# Altium project Smart-Car.PrjPcb
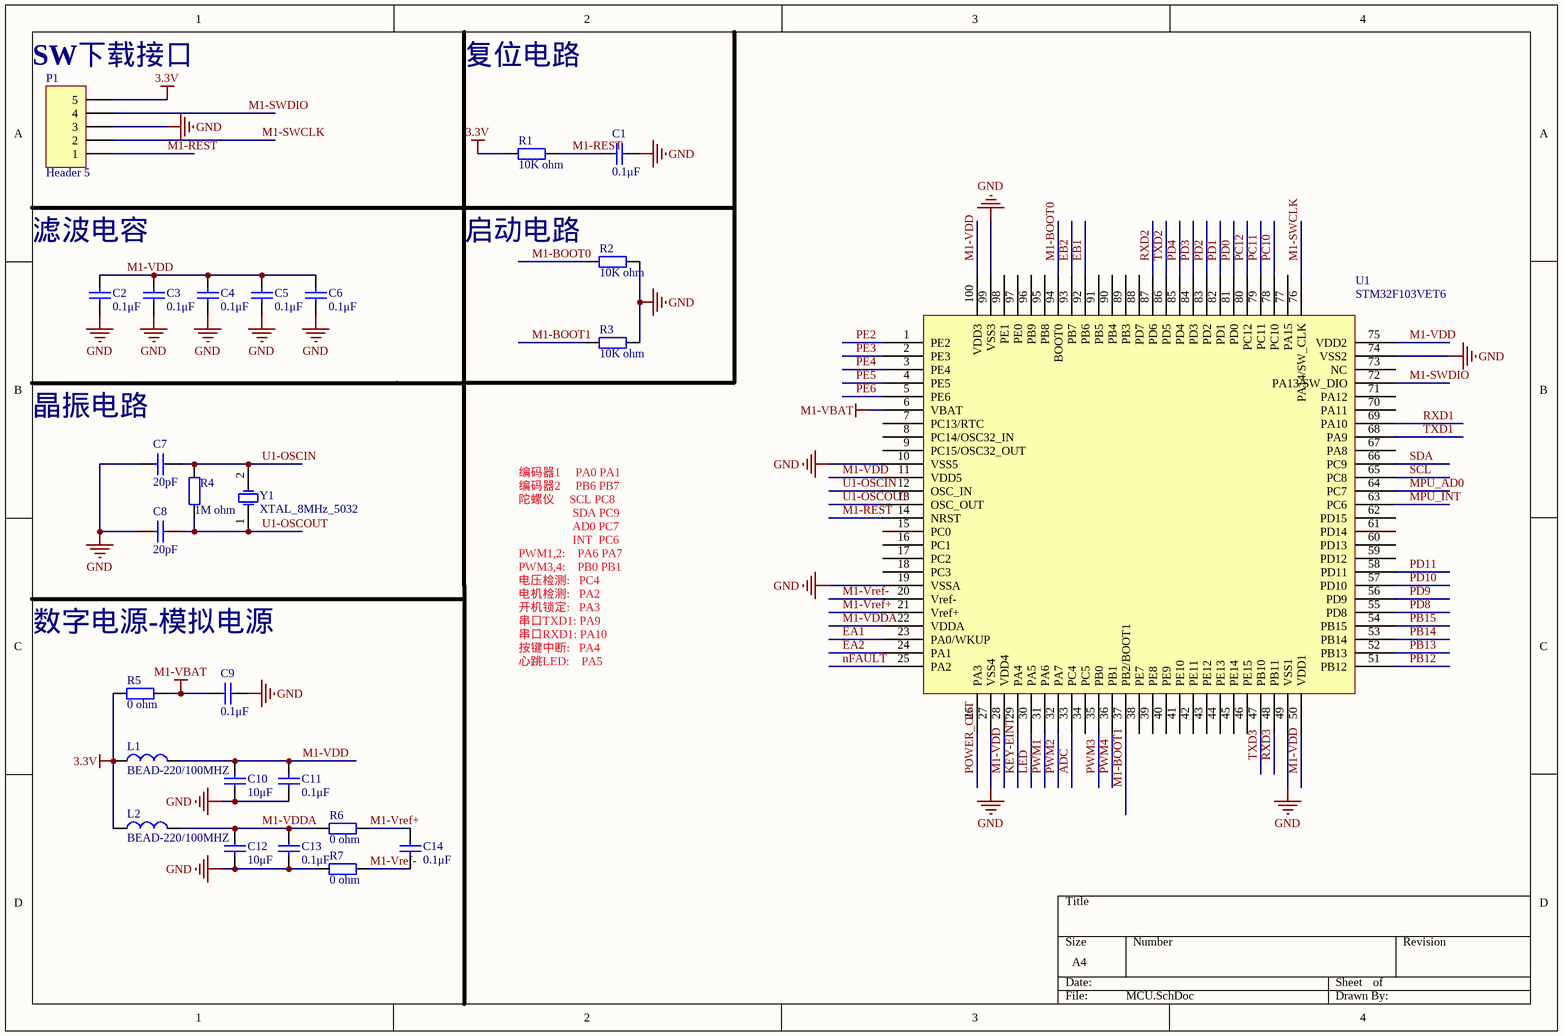
[diagram p0: MCU.SchDoc]
6 sheets, 161 parts. Net scope: global (net labels, ports and power ports of the same name join across sheets).
Board file: Smart-Car.PcbDoc
Sheets:
  MCU.SchDoc
  Power.SchDoc
  Module.SchDoc
  Extend.SchDoc
  KT1025A.SchDoc
  Voice.SchDoc

## Sheet MCU.SchDoc
size A4

### Parts
C1  0.1μF  [0603C]
C2  0.1μF  [0603C]
C3  0.1μF  [0603C]
C4  0.1μF  [0603C]
C5  0.1μF  [0603C]
C6  0.1μF  [0603C]
C7  20pF  [0603C]
C8  20pF  [0603C]
C9  0.1μF  [0603C]
C10  10μF  [0603C]
C11  0.1μF  [0603C]
C12  10μF  [0603C]
C13  0.1μF  [0603C]
C14  0.1μF  [0603C]
L1  BEAD-220/100MHZ  [0603R]
L2  BEAD-220/100MHZ  [0603R]
P1  Header 5  [HDR1X5]
R1  10K ohm  [0603R]
R2  10K ohm  [0603R]
R3  10K ohm  [0603R]
R4  1M ohm  [0603R]
R5  0 ohm  [0603R]
R6  0 ohm  [0603R]
R7  0 ohm  [0603R]
U1  STM32F103VET6  [LQFP100]
Y1  XTAL_8MHz_5032  [5032]

### Nets
3.3V: L1.1 L2.1 P1.5 R1.1 R5.1
GND: C1.2 C2.1 C3.1 C4.1 C5.1 C6.1 C7.1 C8.1 C9.1 C10.1 C11.1 C12.1 C13.1 P1.3 R2.2 R3.2 R7.1 U1.10(VSS5) U1.19(VSSA) U1.27(VSS4) U1.49(VSS1) U1.74(VSS2) U1.99(VSS3)
M1-VBAT: C9.2 R5.2 U1.6(VBAT)
ADC: U1.33(PC4)
EA1: U1.23(PA0/WKUP)
EA2: U1.24(PA1)
EB1: U1.92(PB6)
EB2: U1.93(PB7)
KEY-EINT: U1.29(PA4)
LED: U1.30(PA5)
M1-BOOT0: R2.1 U1.94(BOOT0)
M1-BOOT1: R3.1 U1.37(PB2/BOOT1)
M1-REST: C1.1 P1.1 R1.2 U1.14(NRST)
M1-SWCLK: P1.2 U1.76(PA14/SW_CLK)
M1-SWDIO: P1.4 U1.72(PA13/SW_DIO)
M1-VDD: C2.2 C3.2 C4.2 C5.2 C6.2 C10.2 C11.2 L1.2 U1.11(VDD5) U1.28(VDD4) U1.50(VDD1) U1.75(VDD2) U1.100(VDD3)
M1-VDDA: C12.2 C13.2 L2.2 R6.1 U1.22(VDDA)
M1-Vref+: C14.2 R6.2 U1.21(Vref+)
M1-Vref-: C14.1 R7.2 U1.20(Vref-)
MPU_AD0: U1.64(PC7)
MPU_INT: U1.63(PC6)
nFAULT: U1.25(PA2)
PB12: U1.51(PB12)
PB13: U1.52(PB13)
PB14: U1.53(PB14)
PB15: U1.54(PB15)
PC10: U1.78(PC10)
PC11: U1.79(PC11)
PC12: U1.80(PC12)
PD0: U1.81(PD0)
PD1: U1.82(PD1)
PD2: U1.83(PD2)
PD3: U1.84(PD3)
PD4: U1.85(PD4)
PD8: U1.55(PD8)
PD9: U1.56(PD9)
PD10: U1.57(PD10)
PD11: U1.58(PD11)
PE2: U1.1(PE2)
PE3: U1.2(PE3)
PE4: U1.3(PE4)
PE5: U1.4(PE5)
PE6: U1.5(PE6)
POWER_OUT: U1.26(PA3)
PWM1: U1.31(PA6)
PWM2: U1.32(PA7)
PWM3: U1.35(PB0)
PWM4: U1.36(PB1)
RXD1: U1.69(PA10)
RXD2: U1.87(PD6)
RXD3: U1.48(PB11)
SCL: U1.65(PC8)
SDA: U1.66(PC9)
TXD1: U1.68(PA9)
TXD2: U1.86(PD5)
TXD3: U1.47(PB10)
U1-OSCIN: C7.2 R4.2 U1.12(OSC_IN) Y1.2(OSC2)
U1-OSCOUT: C8.2 R4.1 U1.13(OSC_OUT) Y1.1(OSC1)

Not connected (* = marked no-connect by the designer): U1 7(PC13/RTC) 8(PC14/OSC32_IN) 9(PC15/OSC32_OUT) 15(PC0) 16(PC1) 17(PC2) 18(PC3) 34(PC5) 38(PE7) 39(PE8) 40(PE9) 41(PE10) 42(PE11) 43(PE12) 44(PE13) 45(PE14) 46(PE15) 59(PD12) 60(PD13) 61(PD14) 62(PD15) 67(PA8) 70(PA11) 71(PA12) 73(NC) 77(PA15) 88(PD7) 89(PB3) 90(PB4) 91(PB5) 95(PB8) 96(PB9) 97(PE0) 98(PE1)

### Notes on the sheet
- (near P1) SW下载接口
- 复位电路
- 滤波电容
- 启动电路
- 晶振电路
- 数字电源-模拟电源
- 编码器1     PA0 PA1
  编码器2     PB6 PB7
  陀螺仪     SCL PC8
  SDA PC9
  AD0 PC7
  INT  PC6
  PWM1,2:    PA6 PA7
  PWM3,4:    PB0 PB1
  电压检测:   PC4
  电机检测:   PA2
  开机锁定:   PA3
  串口TXD1: PA9
  串口RXD1: PA10
  按键中断:   PA4
  心跳LED:    PA5

### Library data of the parts
C1-C6 C9 C11 C13 C14 = Cap_0.1μF_50V_0603: 0.1μF_50V,X7R,±5%; 物料名称: 贴片陶瓷电容; 制造商: muRata; 物料编码: TCC0087; 物料型号: GRM188R71H104JA93D; 单位: PCS; 物料规格: 0.1μF_50V,X7R,±5%
C7 C8 = Cap_20pF_50V_0603: 20pF_50V,CH,±5%; 物料名称: 贴片陶瓷电容; 制造商: muRata; 物料编码: TCC0036; 物料型号: GRM1882C1H200JA01D; 单位: PCS; 物料规格: 20pF_50V,CH,±5%
C10 C12 = Cap_10μF_35V_0603: 10μF_35V,X5R,20%; 物料规格: 10μF_35V,20%; 物料名称: 贴片陶瓷电容; 制造商: muRata; 物料编码: TCC0071; 物料型号: GRM188R6YA106MA73D; 单位: PCS
L1 L2 = BEAD-220/100MHZ_0603: 物料名称: 磁珠; 制造商: TDK; 物料编码: TCZ0006; 物料型号: MMZ1608B221CTAH0; 单位: PCS; 物料规格: BEAD-220/100MHZ
P1 = Header 5: Header, 5-Pin; LatestRevisionDate: 17-Jul-2002; LatestRevisionNote: Re-released for DXP Platform.; Publisher: Altium Limited
R1-R3 = Res_10K ohm_0603: 10K ohm,1%; 物料名称: 贴片电阻; 制造商: YAGEO; 物料编码: TRS0020; 物料型号: RC0603FR-0710KL; 单位: PCS; 物料规格: 10K ohm,1%
R4 = Res_1M ohm_0603: 1M ohm,1%; 物料名称: 贴片电阻; 制造商: YAGEO; 物料编码: TRS0067; 物料型号: RC0603FR-071ML; 单位: PCS; 物料规格: 1M ohm,1%
R5-R7 = Res_0 ohm_0603: 0 ohm,5%; 物料名称: 贴片电阻; 制造商: YAGEO; 物料编码: TRS0003; 物料型号: RC0603JR-070RL; 单位: PCS; 物料规格: 0 ohm,5%
U1 = STM32F103VET6: 物料名称: 32位微处理器; 制造商: ST; 物料编码: TIC0019; 单位: PCS; 物料规格: STM32F103VET6; 物料型号: STM32F103VET6
Y1 = XTAL_8MHz_5032: XTAL_8MHz; 物料规格: 8MHz; 物料名称: 晶振; 制造商: TAITIEN; 物料编码: NA; 物料型号: XIHCCCNANF-8.000; 单位: PCS

## Sheet Power.SchDoc
size A3
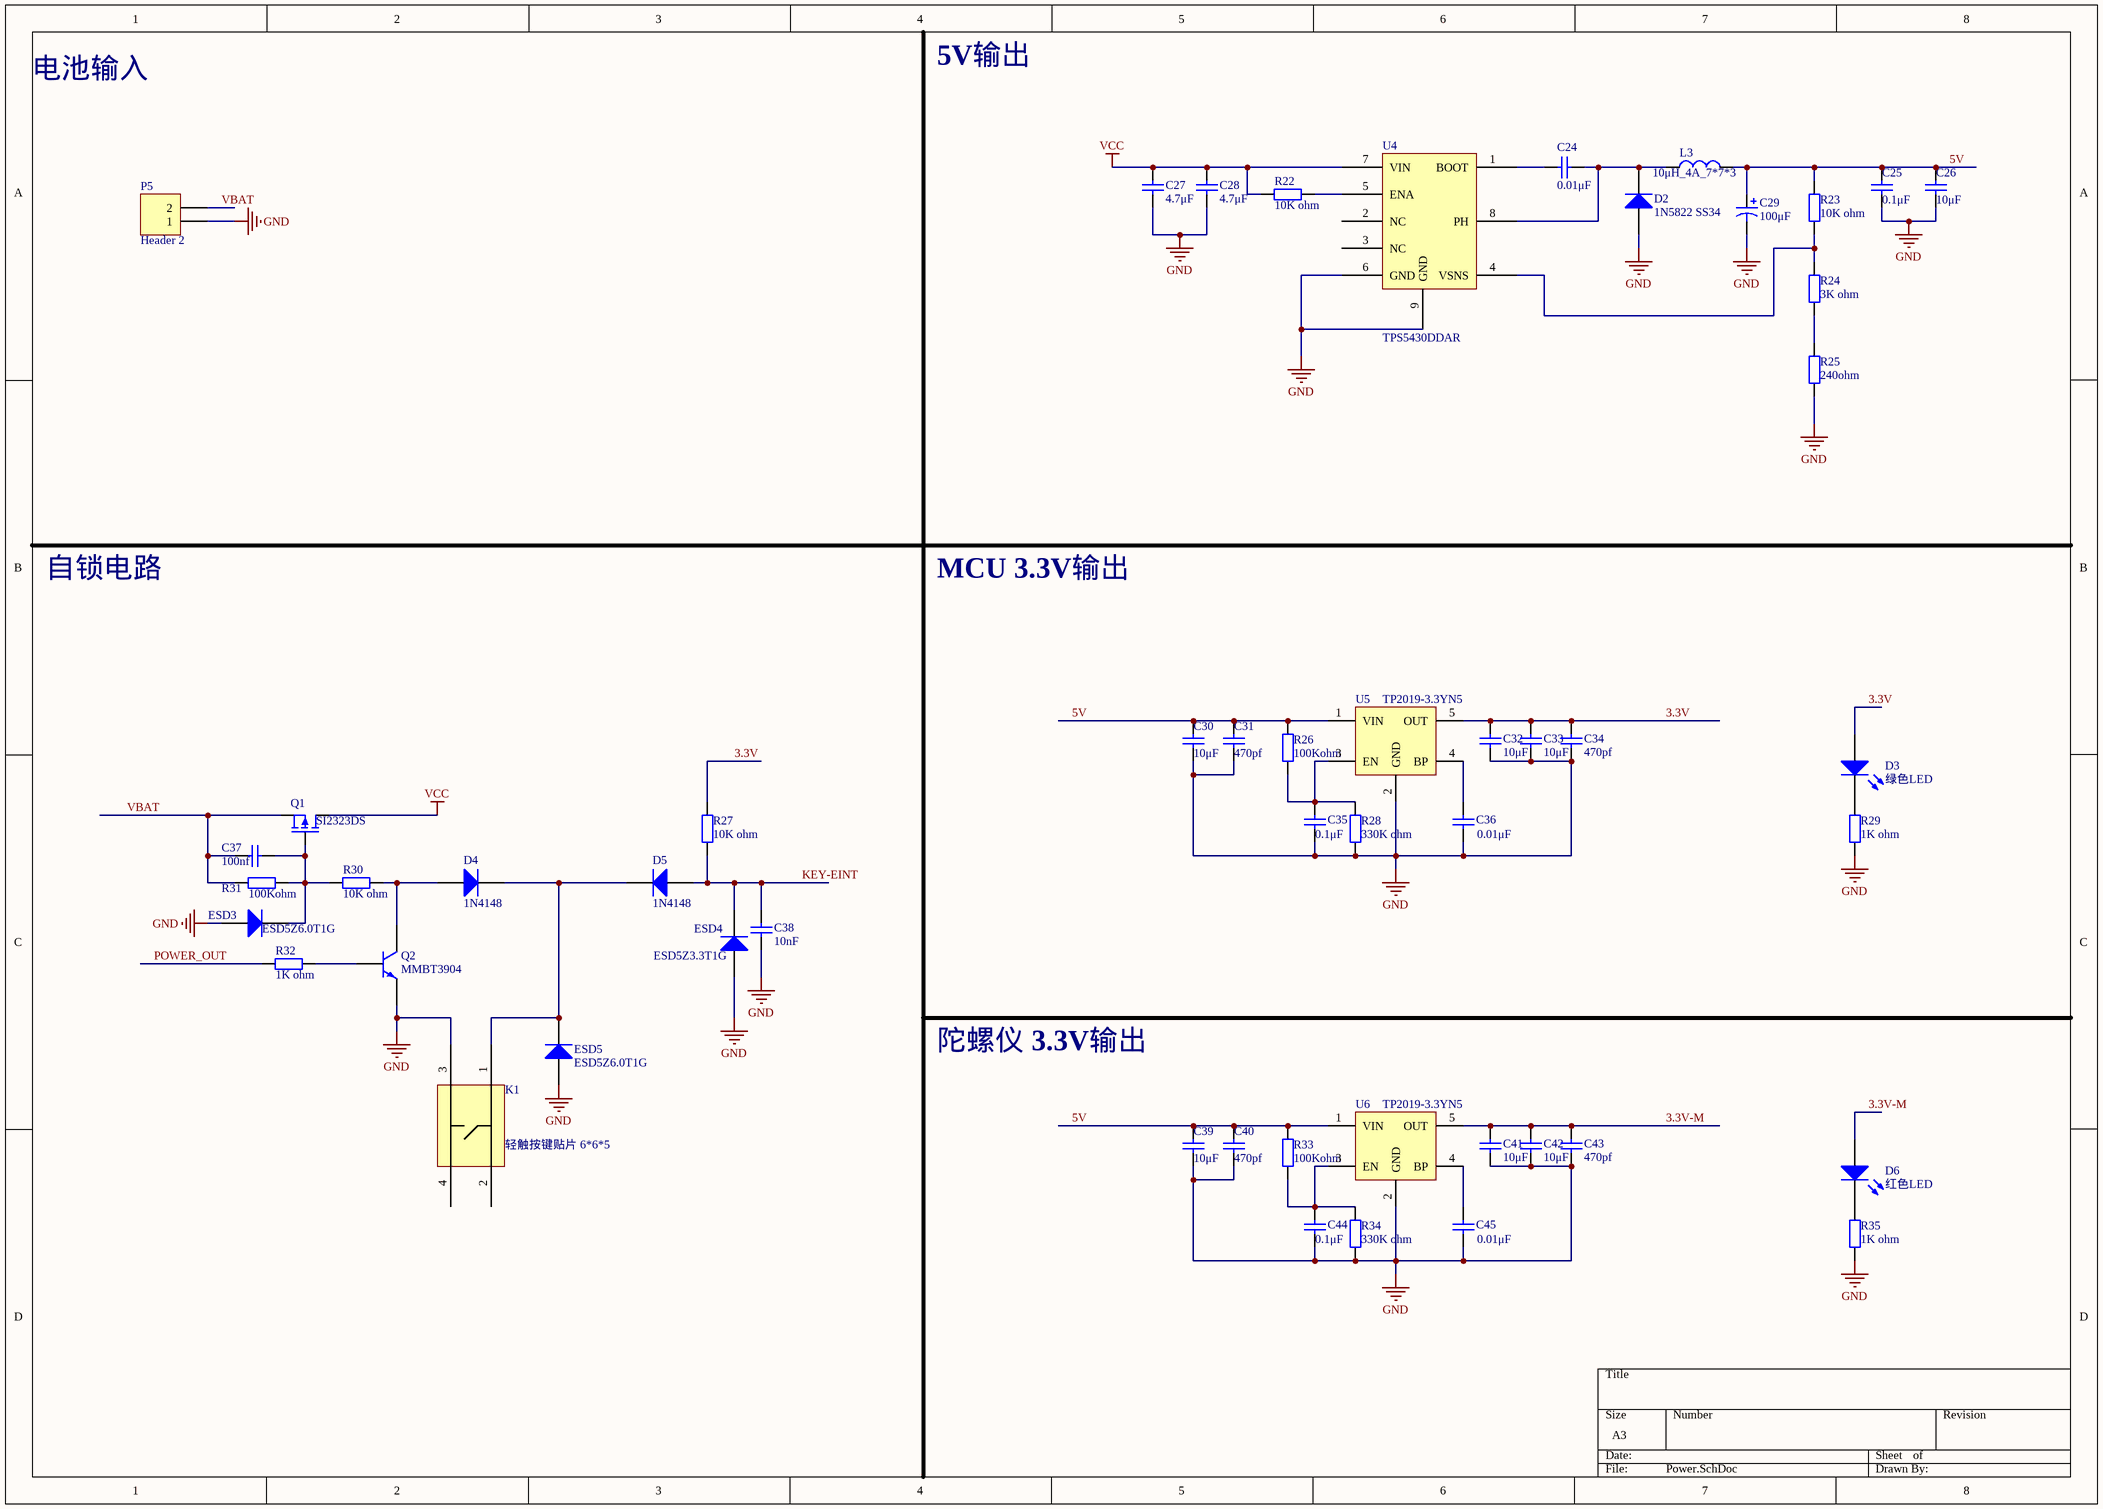
[diagram p1: Power.SchDoc]

### Parts
C24  0.01μF  [0603C]
C25  0.1μF  [0603C]
C26  10μF  [1206C]
C27  4.7μF  [1206C]
C28  4.7μF  [1206C]
C29  100μF  [D7343C]
C30  10μF  [0603C]
C31  470pf  [0603C]
C32  10μF  [0603C]
C33  10μF  [0603C]
C34  470pf  [0603C]
C35  0.1μF  [0603C]
C36  0.01μF  [0603C]
C37  100nf  [0603C]
C38  10nF  [0603C]
C39  10μF  [0603C]
C40  470pf  [0603C]
C41  10μF  [0603C]
C42  10μF  [0603C]
C43  470pf  [0603C]
C44  0.1μF  [0603C]
C45  0.01μF  [0603C]
D2  1N5822 SS34  [SMA-small]
D3  绿色LED  [0603LED]
D4  1N4148  [SOD323]
D5  1N4148  [SOD323]
D6  红色LED  [0603LED]
ESD3  ESD5Z6.0T1G  [SOD523]
ESD4  ESD5Z3.3T1G  [SOD523]
ESD5  ESD5Z6.0T1G  [SOD523]
K1  轻触按键贴片 6*6*5  [轻触按键贴片 6*6*5]
L3  10μH_4A_7*7*3  [7*7*3mm - 06030]
P5  Header 2  [HDR1X2]
Q1  SI2323DS  [SOT-23]
Q2  MMBT3904  [SOT-23]
R22  10K ohm  [0603R]
R23  10K ohm  [0603R]
R24  3K ohm  [0603R]
R25  240ohm  [0603R]
R26  100Kohm  [0603R]
R27  10K ohm  [0603R]
R28  330K ohm  [0603R]
R29  1K ohm  [0603R]
R30  10K ohm  [0603R]
R31  100Kohm  [0603R]
R32  1K ohm  [0603R]
R33  100Kohm  [0603R]
R34  330K ohm  [0603R]
R35  1K ohm  [0603R]
U4  TPS5430DDAR  [SOIC8-PAD]
U5  TP2019-3.3YN5  [SOT-23-5]
U6  TP2019-3.3YN5  [SOT-23-5]

### Nets
3.3V: C32.2 C33.2 C34.2 D3.1(A) R27.2 U5.5(OUT)
GND: C25.1 C26.1 C27.2 C28.1 C29.2 C30.1 C31.1 C32.1 C33.1 C34.1 C35.1 C36.1 C38.1 C39.1 C40.1 C41.1 C42.1 C43.1 C44.1 C45.1 D2.1(A) ESD3.1(A) ESD4.1(A) ESD5.1(A) K1.3 P5.1 Q2.3(E) R25.1 R28.1 R29.1 R34.1 R35.1 U4.6(GND) U4.9(GND) U5.2(GND) U6.2(GND)
VCC: C27.1 C28.2 Q1.2(D) R22.1 U4.7(VIN)
3.3V-M: C41.2 C42.2 C43.2 D6.1(A) U6.5(OUT)
5V: C25.2 C26.2 C29.1 C30.2 C31.2 C39.2 C40.2 L3.2 R23.2 R26.2 R33.2 U5.1(VIN) U6.1(VIN)
KEY-EINT: C38.2 D5.1(A) ESD4.2(K) R27.1
POWER_OUT: R32.1
VBAT: C37.1 P5.2 Q1.3(S) R31.1
NetC24_1: C24.1 U4.1(BOOT)
NetC24_2: C24.2 D2.2(K) L3.1 U4.8(PH)
NetC35_2: C35.2 R26.1 R28.2 U5.3(EN)
NetC36_2: C36.2 U5.4(BP)
NetC37_2: C37.2 ESD3.2(K) Q1.1(G) R30.1 R31.2
NetC44_2: C44.2 R33.1 R34.2 U6.3(EN)
NetC45_2: C45.2 U6.4(BP)
NetD3_2: D3.2(K) R29.2
NetD4_1: D4.1(A) Q2.2(C) R30.2
NetD4_2: D4.2(K) D5.2(K) ESD5.2(K) K1.1
NetD6_2: D6.2(K) R35.2
NetQ2_1: Q2.1(B) R32.2
NetR22_2: R22.2 U4.5(ENA)
NetR23_1: R23.1 R24.2 U4.4(VSNS)
NetR24_1: R24.1 R25.2

Not connected (* = marked no-connect by the designer): K1 2 4; U4 2(NC) 3(NC)

### Notes on the sheet
- 电池输入
- 5V输出
- 自锁电路
- MCU 3.3V输出
- 陀螺仪 3.3V输出

### Library data of the parts
C24 C36 C45 = Cap_0.01μF_50V_0603: 0.01μF_50V,C0G,5%; 物料名称: 贴片陶瓷电容; 制造商: muRata; 物料编码: TCC0038; 物料型号: GRM1885C1H103JA01D; 单位: PCS; 物料规格: 0.01μF_50V,C0G,5%
C25 C35 C44 = Cap_0.1μF_50V_0603: as C1 on sheet MCU; 物料规格: 0.1μF_50V,X7R,±5%
C26 = Cap_10μF_10V_1206: 10μF_10V,10%; 物料名称: 贴片陶瓷电容; 制造商: TDK; 物料编码: TCC0048; 物料型号: C3216JB1A106KT; 单位: PCS; 物料规格: 10μF_10V,10%
C27 C28 = Cap_4.7μF_35V_1206: 4.7μF_35VJB,±10%; 物料名称: 贴片陶瓷电容; 制造商: TDK; 物料编码: NA; 物料型号: C3216JB1V475K085AB; 单位: PCS; 物料规格: 4.7μF_35VJB,±10%
C29 = Cap_100μF_16V_D7343: 100μF_16V; 物料名称: 钽电容; 制造商: AVX; 物料编码: NA; 物料型号: TAJC107M016RNJ; 单位: PCS; 物料规格: 100μF_16V
C30 C32 C33 C39 C41 C42 = Cap_10μF_35V_0603: as C10 on sheet MCU
C31 C34 C40 C43 = Cap_470pf_50V_0603: 470pf_50V,X7R,10%; 物料名称: 贴片陶瓷电容; 制造商: muRata; 物料编码: NA; 单位: PCS; 物料规格: 470pf_50V,X7R,10%; 物料型号: NA
C37 = Cap_100nf_50V_0603: 100nf_50V,X5R,10%; 物料名称: 贴片陶瓷电容; 制造商: muRata; 单位: PCS; 物料规格: 100nf_50V,X5R,10%
C38 = Cap_10nF_16V_0603: 10nF/16V,0603; 物料名称: 贴片陶瓷电容; 制造商: YAGEO; 物料编码: NA; 单位: PCS; 物料规格: Cap_10nF_16V_0603; 物料型号: NA
D2 = 1N5822 SS34_SMA: 物料名称: 表贴齐纳二极管; 制造商: VISHAY; 物料编码: NA; 单位: PCS; 物料规格: 1N5822 SS34; 物料型号: 1N5822 SS34
D3 D6 = 蓝色LED: 物料规格: LED(蓝色）; 制造商: VISHAY; 物料编码: TRG0035; 物料型号: TLMB1100; 单位: PCS; 物料名称: LED(蓝色）
D4 D5 = 1N4148WS_SOD323: 1N4148WS; 物料名称: 表贴齐纳二极管; 制造商: DIODES; 物料编码: NA; 物料型号: 1N4148WS / BAV16WS; 单位: PCS; 物料规格: 1N4148
ESD3 ESD5 = ESD5Z6.0T1G_SOD523: 物料名称: ESD二极管; 制造商: 安森美; 物料编码: NA; 单位: PCS; 物料规格: ESD5Z6.0T1G; 物料型号: ESD5Z6.0T1G
ESD4 = ESD5Z3.3T1G_SOD523: 物料名称: ESD二极管; 制造商: 安森美; 物料编码: NA; 单位: PCS; 物料规格: ESD5Z3.3T1G; 物料型号: ESD5Z3.3T1G
K1 = 轻触按键贴片 6*6*5: 制造商: 淘宝; 物料编码: NA; 单位: PCS; 物料规格: 轻触按键贴片 6*6*5; 物料名称: 轻触按键贴片 6*6*5; 物料型号: 轻触按键贴片 6*6*5
L3 = 10μH_4A_7*7*3: 10μH_4A; 物料名称: 功率电感; 制造商: 台湾奇力新; 物料编码: NA; 物料型号: MHCC10040-100M-R7_06030; 单位: PCS; 物料规格: 10μH_4A_7*7*3
P5 = Header 2: Header, 2-Pin; LatestRevisionDate: 17-Jul-2002; LatestRevisionNote: Re-released for DXP Platform.; Publisher: Altium Limited
Q1 = SI2323DS: 物料名称: NMOS; 制造商: VISHAY; 物料编码: NA; 单位: PCS; 物料规格: SI2323DS; 物料型号: SI2323DS
Q2 = MMBT3904: 物料名称: NPN三极管; 制造商: NXP; 物料编码: TSG0006; 单位: PCS; 物料规格: MMBT3904; 物料型号: MMBT3904
R22 R23 R27 R30 = Res_10K ohm_0603: as R1 on sheet MCU; 物料规格: 10K ohm,1%
R24 = Res_3K ohm_0603: 3K ohm,1%; 物料名称: 贴片电阻; 制造商: YAGEO; 单位: PCS; 物料规格: 3K ohm,1%
R25 = Res_240ohm_0603: 240ohm,1%; 物料名称: 贴片电阻; 制造商: YAGEO; 物料编码: NA; 物料型号: RC0603FR-07240RL; 单位: PCS; 物料规格: 240ohm,1%
R26 R33 = Res_100Kohm_0603: 100K ohm_1%; 物料名称: 贴片电阻; 制造商: YAGEO; 物料编码: TRS0032; 物料型号: RC0603JR-07100K; 单位: PCS; 物料规格: 100K ohm_1%
R28 R34 = Res_330K ohm_0603: 330K ohm,1%; 物料名称: 贴片电阻; 制造商: YAGEO; 物料编码: NA; 物料型号: RC0603FR-07330KL; 单位: PCS; 物料规格: 330K ohm,1%
R29 R32 R35 = Res_1K ohm_0603: 1K ohm,1%; 物料名称: 贴片电阻; 制造商: YAGEO; 物料编码: TRS0043; 物料型号: RC0603FR-071KL; 单位: PCS; 物料规格: 1K ohm,1%
R31 = Res_100Kohm_0603: 100K ohm_5%; 物料名称: 贴片电阻; 制造商: YAGEO; 物料编码: TRS0032; 物料型号: RC0603JR-07100K; 单位: PCS; 物料规格: 100K ohm_5%
U4 = TPS5430DDAR: 物料名称: 降压芯片; 制造商: TI; 物料编码: NA; 单位: PCS; 物料规格: TPS5430DDAR; 物料型号: TPS5430DDAR
U5 U6 = TP2019-3.3YN5: 物料名称: 3.3v电源; 制造商: Tech Public 台舟电子; 物料编码: NA; 单位: PCS; 物料规格: TP2019-3.3YN5; 物料型号: TP2019-3.3YN5

## Sheet Module.SchDoc
size A4
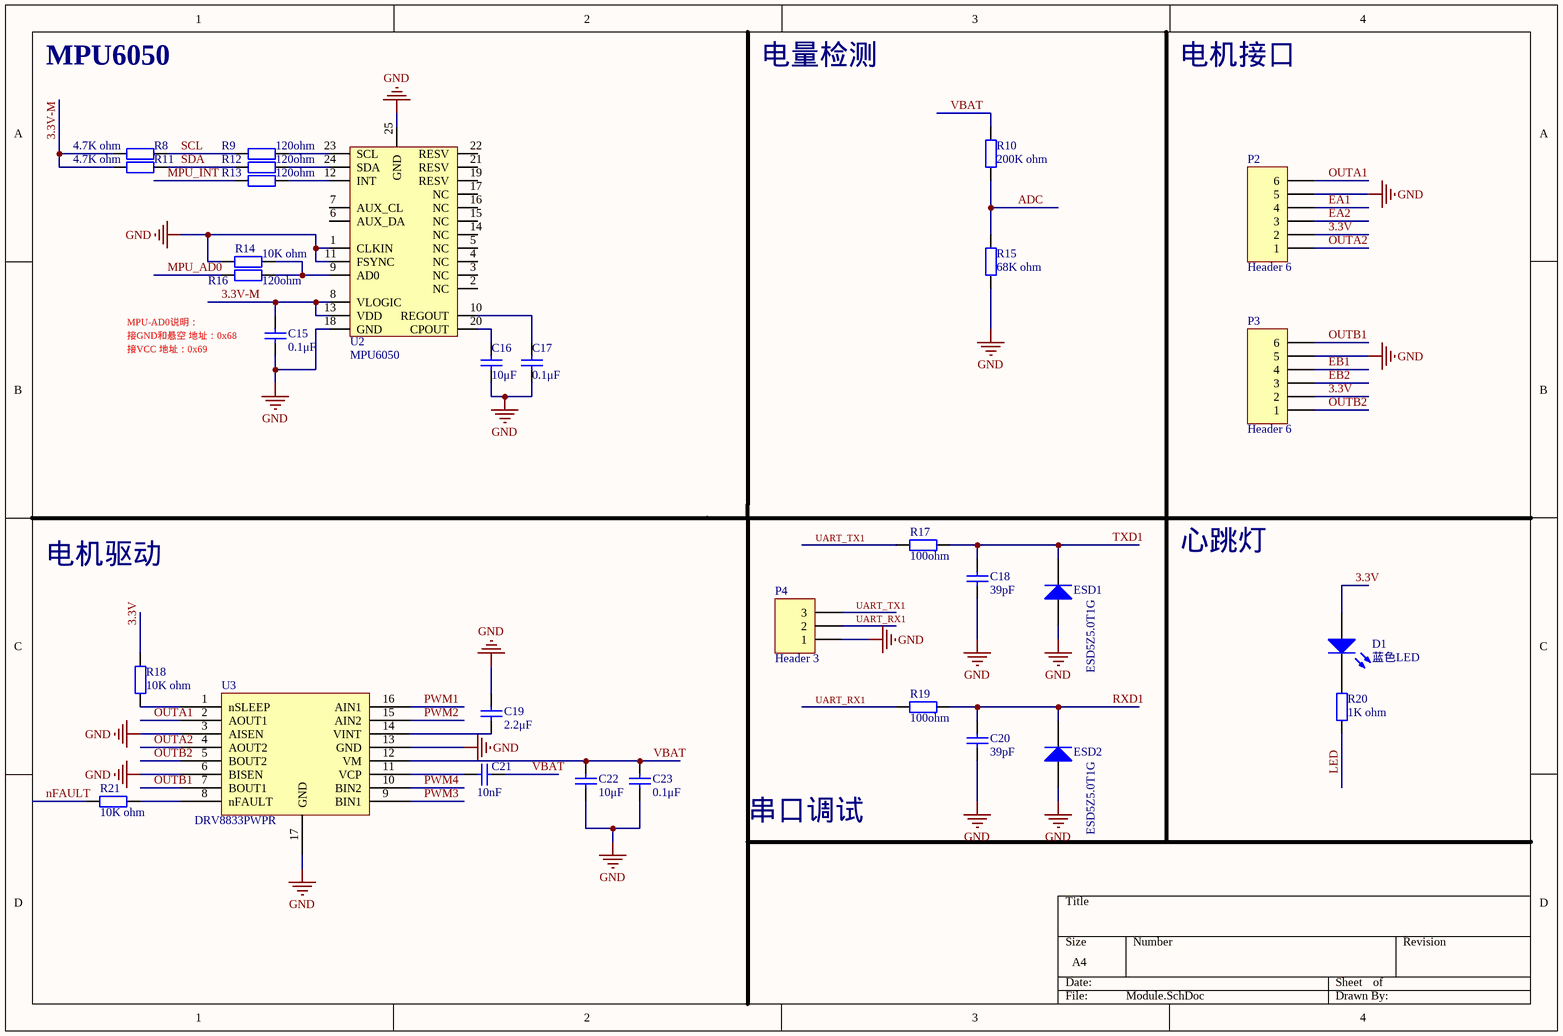
[diagram p2: Module.SchDoc]

### Parts
C15  0.1μF  [0603C]
C16  10μF  [0603C]
C17  0.1μF  [0603C]
C18  39pF  [0603C]
C19  2.2μF  [0603C]
C20  39pF  [0603C]
C21  10nF  [0603C]
C22  10μF  [0603C]
C23  0.1μF  [0603C]
D1  蓝色LED  [0603LED]
ESD1  ESD5Z5.0T1G  [SOD523]
ESD2  ESD5Z5.0T1G  [SOD523]
P2  Header 6  [HDR1X6]
P3  Header 6  [HDR1X6]
P4  Header 3  [HDR1X3]
R8  4.7K ohm  [0603R]
R9  120ohm  [0603R]
R10  200K ohm  [0603R]
R11  4.7K ohm  [0603R]
R12  120ohm  [0603R]
R13  120ohm  [0603R]
R14  10K ohm  [0603R]
R15  68K ohm  [0603R]
R16  120ohm  [0603R]
R17  100ohm  [0603R]
R18  10K ohm  [0603R]
R19  100ohm  [0603R]
R20  1K ohm  [0603R]
R21  10K ohm  [0603R]
U2  MPU6050  [QFN24]
U3  DRV8833PWPR  [TSSOP16]

### Nets
3.3V: D1.1(A) P2.2 P3.2 R18.2
GND: C15.1 C16.1 C17.1 C18.1 C19.2 C20.1 C22.1 C23.1 ESD1.1(A) ESD2.1(A) P2.5 P3.5 P4.1 R14.1 R15.1 U2.1(CLKIN) U2.11(FSYNC) U2.18(GND) U2.25(GND) U3.3(AISEN) U3.6(BISEN) U3.13(GND) U3.17(GND)
3.3V-M: C15.2 R8.1 R11.1 U2.8(VLOGIC) U2.13(VDD)
ADC: R10.1 R15.2
EA1: P2.4
EA2: P2.3
EB1: P3.4
EB2: P3.3
LED: R20.1
MPU_AD0: R16.1
MPU_INT: R13.1
nFAULT: R21.2
OUTA1: P2.6 U3.2(AOUT1)
OUTA2: P2.1 U3.4(AOUT2)
OUTB1: P3.6 U3.7(BOUT1)
OUTB2: P3.1 U3.5(BOUT2)
PWM1: U3.16(AIN1)
PWM2: U3.15(AIN2)
PWM3: U3.9(BIN1)
PWM4: U3.10(BIN2)
RXD1: C20.2 ESD2.2(K) R19.2
SCL: R8.2 R9.1
SDA: R11.2 R12.1
TXD1: C18.2 ESD1.2(K) R17.2
UART_RX1: P4.2 R19.1
UART_TX1: P4.3 R17.1
VBAT: C21.2 C22.2 C23.2 R10.2 U3.12(VM)
NetC16_2: C16.2 U2.20(CPOUT)
NetC17_2: C17.2 U2.10(REGOUT)
NetC19_1: C19.1 U3.14(VINT)
NetC21_1: C21.1 U3.11(VCP)
NetD1_2: D1.2(K) R20.2
NetR9_2: R9.2 U2.23(SCL)
NetR12_2: R12.2 U2.24(SDA)
NetR13_2: R13.2 U2.12(INT)
NetR14_2: R14.2 R16.2 U2.9(AD0)
NetR18_1: R18.1 U3.1(nSLEEP)
NetR21_1: R21.1 U3.8(nFAULT)

Not connected (* = marked no-connect by the designer): U2 2(NC) 3(NC) 4(NC) 5(NC) 6(AUX_DA) 7(AUX_CL) 14(NC) 15(NC) 16(NC) 17(NC) 19(RESV) 21(RESV) 22(RESV)

### Notes on the sheet
- MPU6050
- 电量检测
- 电机接口
- MPU-AD0说明：
- 接GND和悬空 地址：0x68
- 接VCC 地址：0x69
- 电机驱动
- 心跳灯
- 串口调试

### Library data of the parts
C15 C17 C23 = Cap_0.1μF_50V_0603: as C1 on sheet MCU; 物料规格: 0.1μF_50V,X7R,±5%
C16 C22 = Cap_10μF_35V_0603: as C10 on sheet MCU
C18 C20 = Cap_39pF_50V_0603: 39pF_50V,C0G (EIA),±1%; 物料名称: 贴片陶瓷电容; 制造商: muRata; 物料编码: NA; 物料型号: GCM1885C1H390FA16; 单位: PCS; 物料规格: 39pF_50V,C0G (EIA),±1%
C19 = Cap_2.2uF_35V_0603: 2.2μF_35V,±10%; 物料名称: 贴片陶瓷电容; 制造商: TDK; 物料编码: NA; 物料型号: C1608JB1V225K080AC; 单位: PCS; 物料规格: 2.2μF_35V,±10%
C21 = Cap_10nF_50V_0603: 10nF_50V,SL_0603,±5%; 物料名称: 贴片陶瓷电容; 制造商: muRata; 物料编码: NA; 物料型号: GRM1881X1H103JA01; 单位: PCS; 物料规格: 10nF_50V,SL_0603,±5%
D1 = 蓝色LED: as D3 on sheet Power; 物料名称: LED(蓝色）
ESD1 ESD2 = ESD5Z5.0T1G_SOD523: 物料名称: ESD二极管; 制造商: 安森美; 物料编码: NA; 单位: PCS; 物料规格: ESD5Z5.0T1G; 物料型号: ESD5Z5.0T1G
P2 P3 = Header 6: Header, 6-Pin; LatestRevisionDate: 17-Jul-2002; LatestRevisionNote: Re-released for DXP Platform.; Publisher: Altium Limited
P4 = Header 3: Header, 3-Pin; LatestRevisionDate: 17-Jul-2002; LatestRevisionNote: Re-released for DXP Platform.; Publisher: Altium Limited
R8 R11 = Res_4.7K ohm_0603: 4.7K ohm,1%; 物料名称: 贴片电阻; 制造商: YAGEO; 物料型号: AA0603FR-074K7L; 单位: PCS; 物料规格: 4.7K ohm,1%
R9 R12 R13 R16 = Res_120ohm_0603: 120 ohm_5%; 物料名称: 贴片电阻; 制造商: YAGEO; 物料编码: NA; 单位: PCS; 物料规格: 120 ohm_5%; 物料型号: NA
R10 = Res_200K ohm_0603: 200K ohm,1%; 物料名称: 贴片电阻; 制造商: YAGEO; 物料编码: TRS0060; 物料型号: RC0603FR-07200KL; 单位: PCS; 物料规格: 200K ohm,1%
R14 R18 R21 = Res_10K ohm_0603: as R1 on sheet MCU; 物料规格: 10K ohm,1%
R15 = Res_68K ohm_0603: 68K ohm,1%; 物料名称: 贴片电阻; 制造商: YAGEO; 物料编码: NA; 物料型号: RC0603FR-0768KL; 单位: PCS; 物料规格: 68K ohm,1%
R17 R19 = Res_100ohm_0603: 100 ohm_5%; 物料名称: 贴片电阻; 制造商: YAGEO; 物料编码: TRS0010; 物料型号: RC0603JR-07100R; 单位: PCS; 物料规格: 100 ohm_5%
R20 = Res_1K ohm_0603: as R29 on sheet Power; 物料规格: 1K ohm,1%
U2 = MPU6050: 物料名称: 陀螺仪; 制造商: InvenSense; 物料编码: NA; 单位: PCS; 物料规格: MPU6050; 物料型号: MPU6050
U3 = DRV8833PWPR: 物料名称: 有刷直流电机驱动; 制造商: TI; 物料编码: NA; 单位: PCS; 物料规格: DRV8833PWPR; 物料型号: DRV8833PWPR

## Sheet Extend.SchDoc
size A4
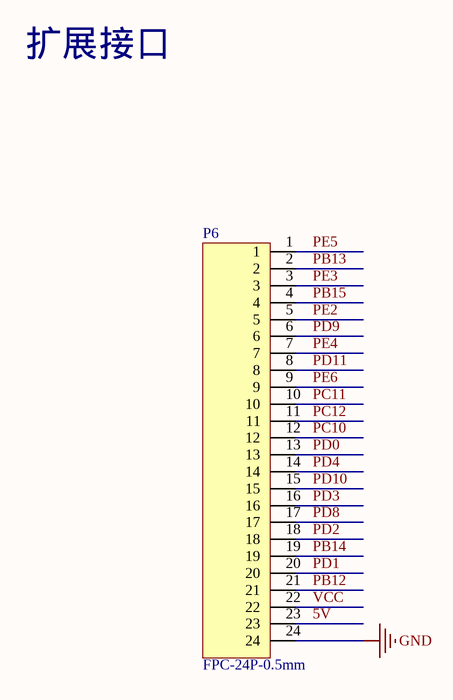
[diagram p3: Extend.SchDoc]

### Parts
P6  FPC-24P-0.5mm  [FPC24-0.5mm]

### Nets
GND: P6.24
VCC: P6.22
5V: P6.23
PB12: P6.21
PB13: P6.2
PB14: P6.19
PB15: P6.4
PC10: P6.12
PC11: P6.10
PC12: P6.11
PD0: P6.13
PD1: P6.20
PD2: P6.18
PD3: P6.16
PD4: P6.14
PD8: P6.17
PD9: P6.6
PD10: P6.15
PD11: P6.8
PE2: P6.5
PE3: P6.3
PE4: P6.7
PE5: P6.1
PE6: P6.9

### Notes on the sheet
- 扩展接口

### Library data of the parts
P6 = FPC-24-0.5mm: 物料名称: FPC座; 物料编码: NA; 单位: PCS; 制造商: 深圳; 物料规格: FPC-24P-0.5mm; 物料型号: FPC-24P-0.5mm

## Sheet KT1025A.SchDoc
size A4
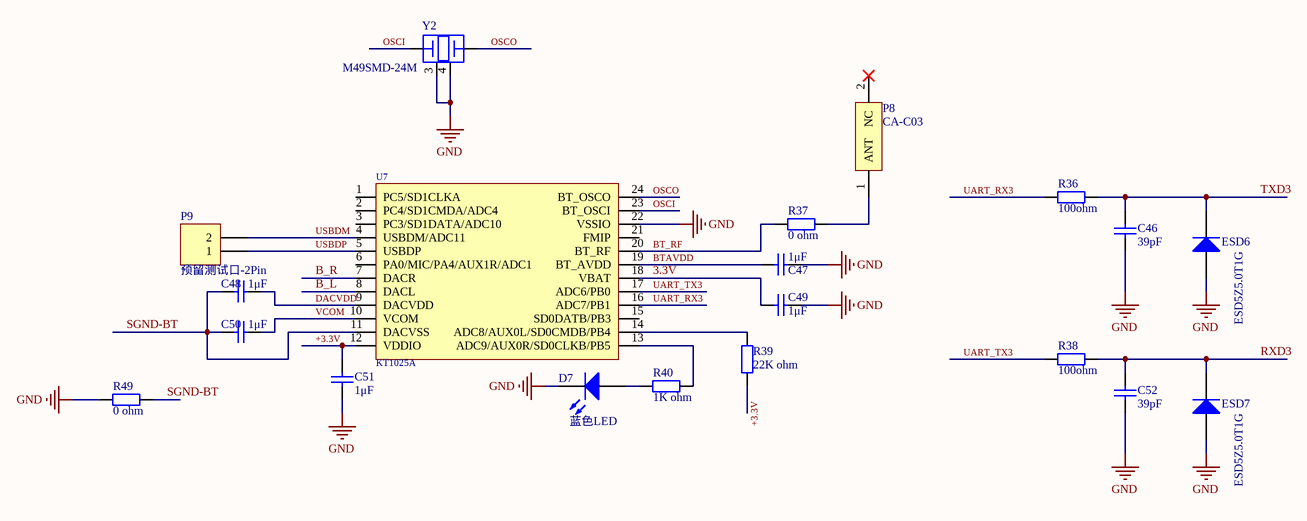
[diagram p4: KT1025A.SchDoc]

### Parts
C46  39pF  [0603C]
C47  1μF  [0603C]
C48  1μF  [0603C]
C49  1μF  [0603C]
C50  1μF  [0603C]
C51  1μF  [0603C]
C52  39pF  [0603C]
D7  蓝色LED  [0603LED]
ESD6  ESD5Z5.0T1G  [SOD523]
ESD7  ESD5Z5.0T1G  [SOD523]
P8  CA-C03  [ANT]
P9  预留测试口-2Pin  [预留测试口 2Pin]
R36  100ohm  [0603R]
R37  0 ohm  [0603R]
R38  100ohm  [0603R]
R39  22K ohm  [0603R]
R40  1K ohm  [0603R]
R49  0 ohm  [0805R]
U7  KT1025A  [SSOP24]
Y2  M49SMD-24M  [M49S]

### Nets
3.3V: C49.1 U7.18(VBAT)
GND: C46.1 C47.2 C49.2 C51.1 C52.1 D7.2(K) ESD6.1(A) ESD7.1(A) R49.1 U7.22(VSSIO) Y2.3 Y2.4
+3.3V: C51.2 R39.1 U7.12(VDDIO)
B_L: U7.8(DACL)
B_R: U7.7(DACR)
BT_RF: R37.1 U7.20(BT_RF)
BTAVDD: C47.1 U7.19(BT_AVDD)
DACVDD: C48.2 U7.9(DACVDD)
OSCI: U7.23(BT_OSCI) Y2.1
OSCO: U7.24(BT_OSCO) Y2.2
RXD3: C52.2 ESD7.2(K) R38.2
SGND-BT: C48.1 C50.1 R49.2 U7.11(DACVSS)
TXD3: C46.2 ESD6.2(K) R36.2
UART_RX3: R36.1 U7.16(ADC7/PB1)
UART_TX3: R38.1 U7.17(ADC6/PB0)
USBDM: P9.2 U7.4(USBDM/ADC11)
USBDP: P9.1 U7.5(USBDP)
VCOM: C50.2 U7.10(VCOM)
NetD7_1: D7.1(A) R40.2
NetP8_1: P8.1(ANT) R37.2
NetR39_2: R39.2 U7.14(ADC8/AUX0L/SD0CMDB/PB4)
NetR40_1: R40.1 U7.13(ADC9/AUX0R/SD0CLKB/PB5)

Not connected (* = marked no-connect by the designer): P8 2(NC)*; U7 1(PC5/SD1CLKA) 2(PC4/SD1CMDA/ADC4) 3(PC3/SD1DATA/ADC10) 6(PA0/MIC/PA4/AUX1R/ADC1) 15(SD0DATB/PB3) 21(FMIP)

### Library data of the parts
C46 C52 = Cap_39pF_50V_0603: as C18 on sheet Module; 物料规格: 39pF_50V,C0G (EIA),±1%
C47-C51 = Cap_1μF_50V_0603: 1μF_50V,X5R,±10%; 物料名称: 贴片陶瓷电容; 制造商: muRata; 物料编码: TCC0040; 物料型号: GRM188R61H105KAALD; 单位: PCS; 物料规格: 1μF_50V,X5R,±10%
D7 = 蓝色LED: as D3 on sheet Power; 物料名称: LED(蓝色）
ESD6 ESD7 = ESD5Z5.0T1G_SOD523: as ESD1 on sheet Module; 物料规格: ESD5Z5.0T1G; 物料型号: ESD5Z5.0T1G
P8 = CA-C03: 物料名称: 蓝牙天线; 制造商: 寒武纪电子; 物料编码: NA; 单位: PCS; 物料规格: CA-C03; 物料型号: CA-C03
P9 = 预留测试口-2Pin: 制造商: NA; 单位: PCS; 物料规格: 预留测试口-2Pin; 物料名称: 预留测试口-2Pin; 物料编码: NA; 物料型号: 预留测试口-2Pin
R36 R38 = Res_100ohm_0603: as R17 on sheet Module; 物料规格: 100 ohm_5%
R37 = Res_0 ohm_0603: as R5 on sheet MCU; 物料规格: 0 ohm,5%
R39 = Res_22K ohm_0603: 22K ohm,1%; 物料名称: 贴片电阻; 制造商: YAGEO; 物料编码: NA; 物料型号: RC0603FR-0722KL; 单位: PCS; 物料规格: 22K ohm,1%
R40 = Res_1K ohm_0603: as R29 on sheet Power; 物料规格: 1K ohm,1%
R49 = Res_0 ohm_0805: 0 ohm,5%; 物料名称: 贴片电阻; 制造商: YAGEO; 物料编码: NA; 物料型号: RC0805JR-070RL; 单位: PCS; 物料规格: 0 ohm,5%
U7 = KT1025A: 物料名称: 蓝牙芯片; 单位: PCS; 物料编码: NA; 制造商: 深圳市清月电子（珠海杰里）; 物料规格: KT1025A; 物料型号: KT1025A
Y2 = M49SMD-24M-10ppm: 物料规格: M49SMD晶振24M; 物料名称: 晶振; 制造商: NA; 单位: PCS; 物料编码: NA; 物料型号: M49SMD晶振24M

## Sheet Voice.SchDoc
size A4
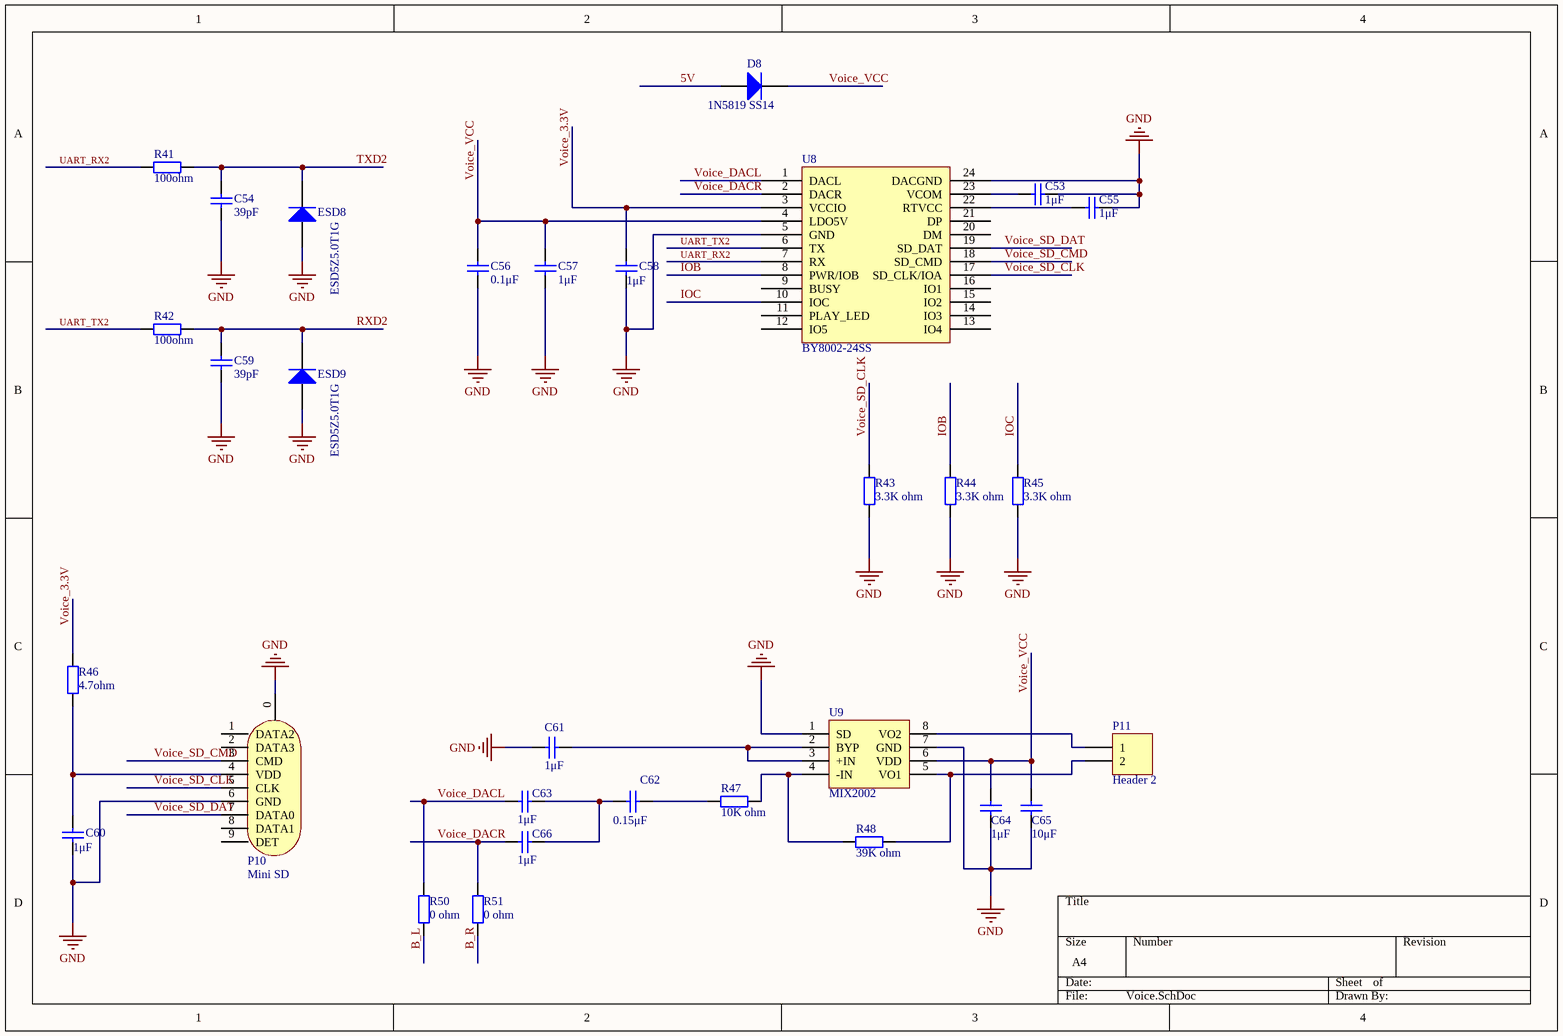
[diagram p5: Voice.SchDoc]

### Parts
C53  1μF  [0603C]
C54  39pF  [0603C]
C55  1μF  [0603C]
C56  0.1μF  [0603C]
C57  1μF  [0603C]
C58  1μF  [0603C]
C59  39pF  [0603C]
C60  1μF  [0603C]
C61  1μF  [0603C]
C62  0.15μF  [0603C]
C63  1μF  [0603C]
C64  1μF  [0603C]
C65  10μF  [0603C]
C66  1μF  [0603C]
D8  1N5819 SS14  [SMA-small]
ESD8  ESD5Z5.0T1G  [SOD523]
ESD9  ESD5Z5.0T1G  [SOD523]
P10  Mini SD  [TF-tan]
P11  Header 2  [HDR1X2]
R41  100ohm  [0603R]
R42  100ohm  [0603R]
R43  3.3K ohm  [0603R]
R44  3.3K ohm  [0603R]
R45  3.3K ohm  [0603R]
R46  4.7ohm  [0603R]
R47  10K ohm  [0603R]
R48  39K ohm  [0603R]
R50  0 ohm  [0603R]
R51  0 ohm  [0603R]
U8  BY8002-24SS  [QSOP-24N]
U9  MIX2002  [SOP8 - NO-HP]

### Nets
GND: C53.1 C54.1 C55.1 C56.1 C57.1 C58.1 C59.1 C60.1 C61.1 C64.1 C65.1 ESD8.1(A) ESD9.1(A) P10.0 P10.6(GND) R43.1 R44.1 R45.1 U8.5(GND) U8.24(DACGND) U9.1(SD) U9.7(GND)
5V: D8.1(A)
B_L: R50.1
B_R: R51.1
IOB: R44.2 U8.8(PWR/IOB)
IOC: R45.2 U8.10(IOC)
RXD2: C59.2 ESD9.2(K) R42.2
TXD2: C54.2 ESD8.2(K) R41.2
UART_RX2: R41.1 U8.7(RX)
UART_TX2: R42.1 U8.6(TX)
Voice_3.3V: C58.2 R46.2 U8.3(VCCIO)
Voice_DACL: C63.1 R50.2 U8.1(DACL)
Voice_DACR: C66.1 R51.2 U8.2(DACR)
Voice_SD_CLK: P10.5(CLK) R43.2 U8.17(SD_CLK/IOA)
Voice_SD_CMD: P10.3(CMD) U8.18(SD_CMD)
Voice_SD_DAT: P10.7(DATA0) U8.19(SD_DAT)
Voice_VCC: C56.2 C57.2 C64.2 C65.2 D8.2(K) U8.4(LDO5V) U9.6(VDD)
NetC53_2: C53.2 U8.23(VCOM)
NetC55_2: C55.2 U8.22(RTVCC)
NetC60_2: C60.2 P10.4(VDD) R46.1
NetC61_2: C61.2 U9.2(BYP) U9.3(+IN)
NetC62_1: C62.1 C63.2 C66.2
NetC62_2: C62.2 R47.1
NetP11_1: P11.1 U9.8(VO2)
NetP11_2: P11.2 R48.2 U9.5(VO1)
NetR47_2: R47.2 R48.1 U9.4(-IN)

Not connected (* = marked no-connect by the designer): P10 1(DATA2) 2(DATA3) 8(DATA1) 9(DET); U8 9(BUSY) 11(PLAY_LED) 12(IO5) 13(IO4) 14(IO3) 15(IO2) 16(IO1) 20(DM) 21(DP)

### Library data of the parts
C53 C55 C57 C58 C60 C61 C63 C64 C66 = Cap_1μF_50V_0603: as C47 on sheet KT1025A; 物料规格: 1μF_50V,X5R,±10%
C54 C59 = Cap_39pF_50V_0603: as C18 on sheet Module; 物料规格: 39pF_50V,C0G (EIA),±1%
C56 = Cap_0.1μF_50V_0603: as C1 on sheet MCU; 物料规格: 0.1μF_50V,X7R,±5%
C62 = Cap_0.15μF_50V_0603: 0.15μF_50V,X7R,±5%; 物料名称: 贴片陶瓷电容; 制造商: muRata; 物料编码: NA; 单位: PCS; 物料规格: 0.15μF_50V,X7R,±5%; 物料型号: NA
C65 = Cap_10μF_35V_0603: as C10 on sheet MCU
D8 = 1N5819 SS14_SMA: 物料名称: 表贴齐纳二极管; 制造商: VISHAY; 物料编码: NA; 单位: PCS; 物料规格: 1N5819 SS14; 物料型号: 1N5819 SS14
ESD8 ESD9 = ESD5Z5.0T1G_SOD523: as ESD1 on sheet Module; 物料规格: ESD5Z5.0T1G; 物料型号: ESD5Z5.0T1G
P10 = Mini SD: 制造商: NA; 物料编码: 深圳; 单位: PCS; 物料规格: Mini SD; 物料名称: Mini SD; 物料型号: Mini SD
P11 = Header 2: Header, 2-Pin; LatestRevisionDate: 17-Jul-2002; LatestRevisionNote: Re-released for DXP Platform.; Publisher: Altium Limited
R41 R42 = Res_100ohm_0603: as R17 on sheet Module; 物料规格: 100 ohm_5%
R43-R45 = Res_3.3K ohm_0603: 3.3K ohm,1%; 物料名称: 贴片电阻; 制造商: YAGEO; 单位: PCS; 物料规格: 3.3K ohm,1%
R46 = Res_4.7ohm_0603: 4.7ohm,1%; 物料名称: 贴片电阻; 制造商: YAGEO; 物料型号: AA0603FR-074R7L; 单位: PCS; 物料规格: 4.7 ohm,1%
R47 = Res_10K ohm_0603: as R1 on sheet MCU; 物料规格: 10K ohm,1%
R48 = Res_39K ohm_0603: 39K ohm,1%; 物料名称: 贴片电阻; 制造商: YAGEO; 物料编码: NA; 物料型号: RC0603FR-0739KL; 单位: PCS; 物料规格: 39K ohm,1%
R50 R51 = Res_0 ohm_0603: as R5 on sheet MCU; 物料规格: 0 ohm,5%
U8 = BY8002-24SS: 物料名称: 音频播放芯片; 制造商: 深圳市百为电子科技有限公司; 物料编码: NA; 单位: PCS; 物料规格: BY8002-24SS; 物料型号: BY8002-24SS
U9 = MIX2002: 物料名称: 2.5W功放; 制造商: Mixinno; 物料编码: NA; 单位: PCS; 物料规格: MIX2002; 物料型号: MIX2002

## Nets that join several sheets
3.3V: MCU (5 pins), Power (6 pins), Module (D1.1 P2.2 P3.2 R18.2), KT1025A (C49.1 U7.18)
GND: MCU (23 pins), Power (36 pins), Module (23 pins), Extend (P6.24), KT1025A (12 pins), Voice (22 pins)
VCC: Power (5 pins), Extend (P6.22)
3.3V-M: Power (5 pins), Module (5 pins)
5V: Power (13 pins), Extend (P6.23), Voice (D8.1)
ADC: MCU (U1.33), Module (R10.1 R15.2)
B_L: KT1025A (U7.8), Voice (R50.1)
B_R: KT1025A (U7.7), Voice (R51.1)
EA1: MCU (U1.23), Module (P2.4)
EA2: MCU (U1.24), Module (P2.3)
EB1: MCU (U1.92), Module (P3.4)
EB2: MCU (U1.93), Module (P3.3)
KEY-EINT: MCU (U1.29), Power (C38.2 D5.1 ESD4.2 R27.1)
LED: MCU (U1.30), Module (R20.1)
MPU_AD0: MCU (U1.64), Module (R16.1)
MPU_INT: MCU (U1.63), Module (R13.1)
nFAULT: MCU (U1.25), Module (R21.2)
PB12: MCU (U1.51), Extend (P6.21)
PB13: MCU (U1.52), Extend (P6.2)
PB14: MCU (U1.53), Extend (P6.19)
PB15: MCU (U1.54), Extend (P6.4)
PC10: MCU (U1.78), Extend (P6.12)
PC11: MCU (U1.79), Extend (P6.10)
PC12: MCU (U1.80), Extend (P6.11)
PD0: MCU (U1.81), Extend (P6.13)
PD1: MCU (U1.82), Extend (P6.20)
PD2: MCU (U1.83), Extend (P6.18)
PD3: MCU (U1.84), Extend (P6.16)
PD4: MCU (U1.85), Extend (P6.14)
PD8: MCU (U1.55), Extend (P6.17)
PD9: MCU (U1.56), Extend (P6.6)
PD10: MCU (U1.57), Extend (P6.15)
PD11: MCU (U1.58), Extend (P6.8)
PE2: MCU (U1.1), Extend (P6.5)
PE3: MCU (U1.2), Extend (P6.3)
PE4: MCU (U1.3), Extend (P6.7)
PE5: MCU (U1.4), Extend (P6.1)
PE6: MCU (U1.5), Extend (P6.9)
POWER_OUT: MCU (U1.26), Power (R32.1)
PWM1: MCU (U1.31), Module (U3.16)
PWM2: MCU (U1.32), Module (U3.15)
PWM3: MCU (U1.35), Module (U3.9)
PWM4: MCU (U1.36), Module (U3.10)
RXD1: MCU (U1.69), Module (C20.2 ESD2.2 R19.2)
RXD2: MCU (U1.87), Voice (C59.2 ESD9.2 R42.2)
RXD3: MCU (U1.48), KT1025A (C52.2 ESD7.2 R38.2)
SCL: MCU (U1.65), Module (R8.2 R9.1)
SDA: MCU (U1.66), Module (R11.2 R12.1)
TXD1: MCU (U1.68), Module (C18.2 ESD1.2 R17.2)
TXD2: MCU (U1.86), Voice (C54.2 ESD8.2 R41.2)
TXD3: MCU (U1.47), KT1025A (C46.2 ESD6.2 R36.2)
VBAT: Power (C37.1 P5.2 Q1.3 R31.1), Module (5 pins)